# EAGLE design esp_breakout (EAGLE 8.4.0)
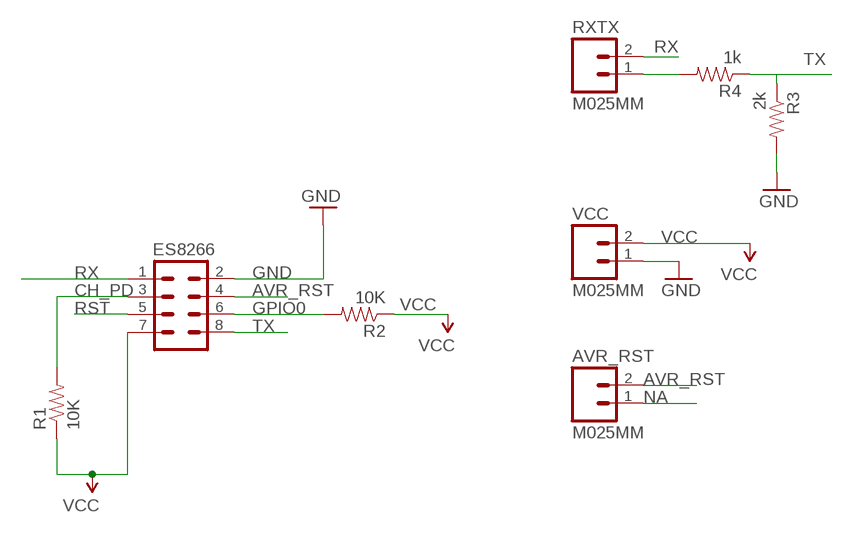
[diagram p0: schematic, sheet 1]

## Parts
AVR_RST  M025MM  [SCREWTERMINAL-5MM-2]
ES8266  M04X2  [2X4]
R1  10K  1KOHM-1/4W-1%(PTH)  [AXIAL-0.3]
R2  10K  1KOHM-1/4W-1%(PTH)  [AXIAL-0.3]
R3  2k  1KOHM-1/4W-1%(PTH)  [AXIAL-0.3]
R4  1k  1KOHM-1/4W-1%(PTH)  [AXIAL-0.3]
RXTX  M025MM  [SCREWTERMINAL-5MM-2]
VCC  M025MM  [SCREWTERMINAL-5MM-2]

## Nets
AVR_RST: AVR_RST.2 ES8266.4
CH_PD: ES8266.3 R1.P$2
GND: ES8266.2 R3.P$2 VCC.1
GPIO0: ES8266.6 R2.P$2
N$1: R4.P$2 RXTX.1
NA: AVR_RST.1
RST: ES8266.5
RX: ES8266.1 RXTX.2
TX: ES8266.8 R3.P$1 R4.P$1
VCC: ES8266.7 R1.P$1 R2.P$1 VCC.2

## Library data of the parts
AVR_RST RXTX VCC = SparkFun-Connectors:M02: Standard 2-pin 0.1" header. Use with - straight break away headers ( PRT-00116) - right angle break away headers (PRT-00553) - swiss pins (PRT-00743) - machine pins (PRT-00117) - female headers (PRT-00115) Molex polarized connector foot print use with: PRT-08233 with associated crimp pins and housings. 2.54_SCREWTERM for use with PRT-10571. 3.5mm Screw Terminal footprints for PRT-08084 5mm Screw Terminal footprints for use with PRT-08433
ES8266 = SparkFun-Connectors:M04X2: .1" header, two rows of four.
R1-R4 = SparkFun-Resistors:1KOHM-1/4W-1%(PTH): RES-12182; PROD_ID: RES-12182; VALUE: 1K

## Board
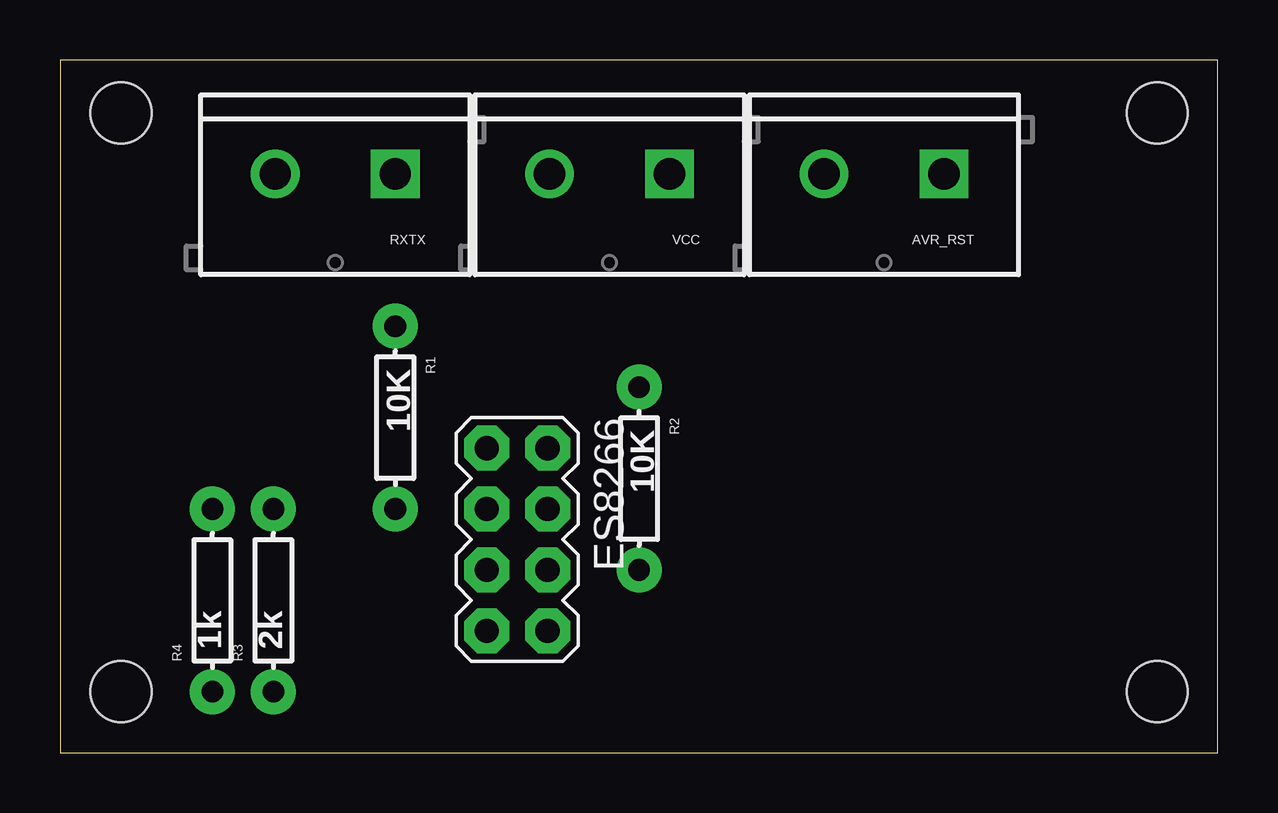
[diagram p1: board, top side]
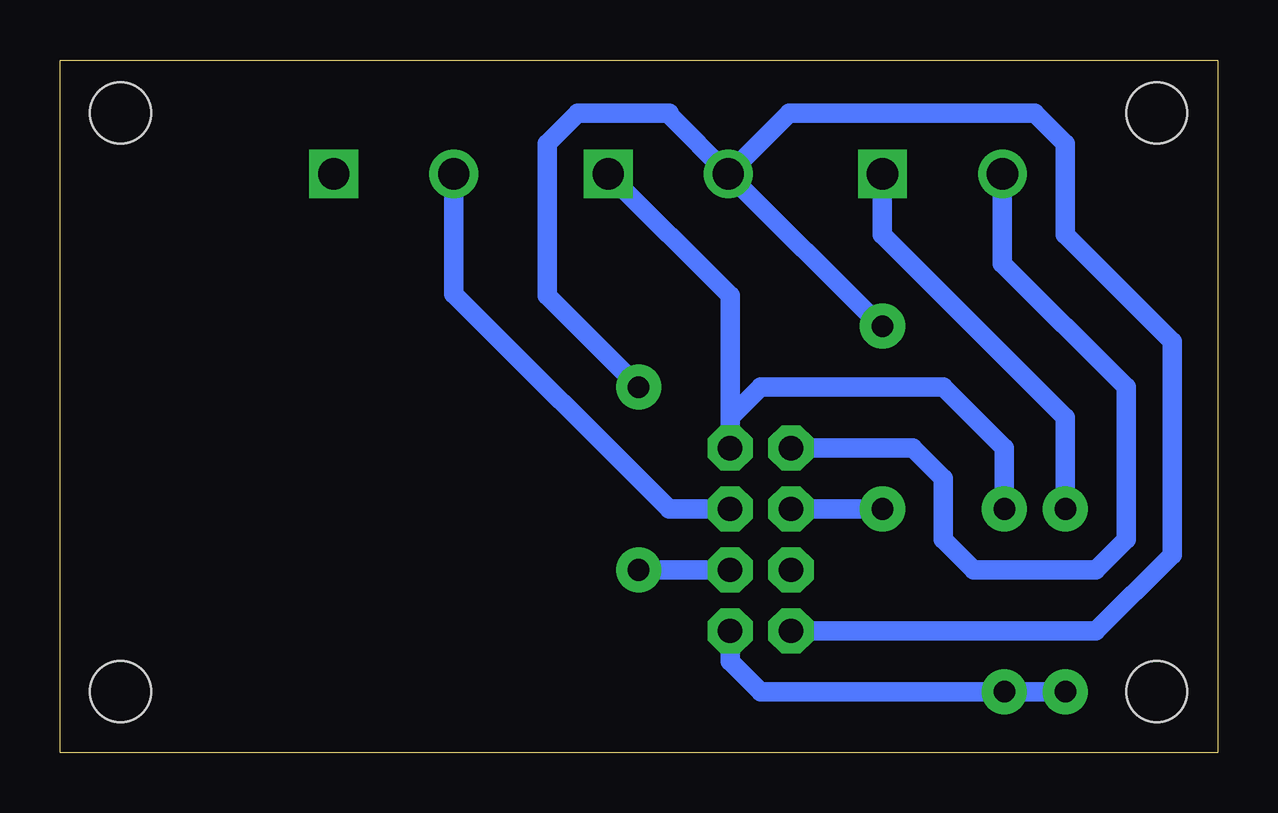
[diagram p2: board, bottom side, seen from below]

Size 48.24 x 28.88 mm. Coordinates in mm from the lower left corner, seen from the top.
Outline: 0,0 48.24,0 48.24,28.88 0,28.88 0,0
Copper layers (1*16): Top 0.035mm / dielectric 1.5mm / Bottom 0.035mm
Design rules "OthermillDRC_1_64_v2": minimum track width 16mil, minimum drill 31mil, track to track 0.39878125mm, track to pad 0.39878125mm, pad to pad 0.39878125mm, via to via 0.39878125mm, smd to smd 0mil, copper to edge 0mil, drill to drill 1mil, minimum pad ring 0mil, minimum via ring 15mil, stop-mask expansion 1mil, vias tented up to drill 30mil, thermal gap 10mil
Holes 2.54 mm at 2.54,2.54 2.54,26.67 45.72,2.54 45.72,26.67

### Footprints (pad centres in the part's own frame; a part is rotated, then mirrored left to right if it is on the bottom)
SCREWTERMINAL-5MM-2 = drill 1.3 pad 2.032 square: 1 0,0 | drill 1.3 pad 2.032: 2 5,0
2X4 = drill 1.016 pad 1.88 octagon: 1 -3.81,-1.27; 2 -3.81,1.27; 3 -1.27,-1.27; 4 -1.27,1.27; 5 1.27,-1.27; 6 1.27,1.27; 7 3.81,-1.27; 8 3.81,1.27
AXIAL-0.3 = drill 0.9 pad 1.88: P$1 -3.81,0; P$2 3.81,0

### Placement (x,y rotation side)
AVR_RST  36.83,24.13 180 top
ES8266  19.05,8.89 270 top
R1  13.97,13.97 270 top
R2  24.13,11.43 270 top
R3  8.89,6.35 90 top
R4  6.35,6.35 90 top
RXTX  13.97,24.13 180 top
VCC  25.4,24.13 180 top

### Tracks (layer width: path | path; a pad name or v marks a point on that pad's centre or on a via)
AVR_RST
  Bottom 0.813: ES8266.4 22.86,10.16 31.83,19.13 AVR_RST.2
CH_PD
  Bottom 0.813: ES8266.3 R1.P$2
GND
  Bottom 0.813: R3.P$2 8.89,12.7 11.43,15.24 19.05,15.24 20.32,13.97 ES8266.2 20.32,19.05 VCC.1
GPIO0
  Bottom 0.813: R2.P$2 ES8266.6
N$1
  Bottom 0.813: R4.P$2 6.35,13.97 13.97,21.59 RXTX.1
RX
  Bottom 0.813: ES8266.1 12.7,12.7 11.43,11.43 11.43,8.89 10.16,7.62 5.08,7.62 3.81,8.89 3.81,15.24 8.97,20.4 RXTX.2
TX
  Bottom 0.813: R4.P$1 R3.P$1 19.05,2.54 20.32,3.81 ES8266.8
VCC
  Bottom 0.813: R1.P$1 14.05,17.78 VCC.2 | VCC.2 22.86,26.59 22.86,26.67 26.67,26.67 27.94,25.4 27.94,19.05 R2.P$1 | ES8266.7 5.08,5.08 1.91,8.26 | 1.91,8.26 1.91,8.51 | 1.91,8.26 1.91,17.14 6.35,21.59 6.35,25.4 7.62,26.67 17.86,26.67 VCC.2